# Altium schematic sheet Mynd_LINE_IN_JACK.SchDoc: Mynd-Line-In-Jack
size A3; ApprovedBy: Jianhua.zhong; CheckedBy: Aileen.Zheng; DrawnBy: GuoHui.Lin; Revision: 3.2; SheetNumber: 1; SheetTotal: 1; Model NO.: PS2307; ISSUE DATE: 20230820; REV DATE: 202301025
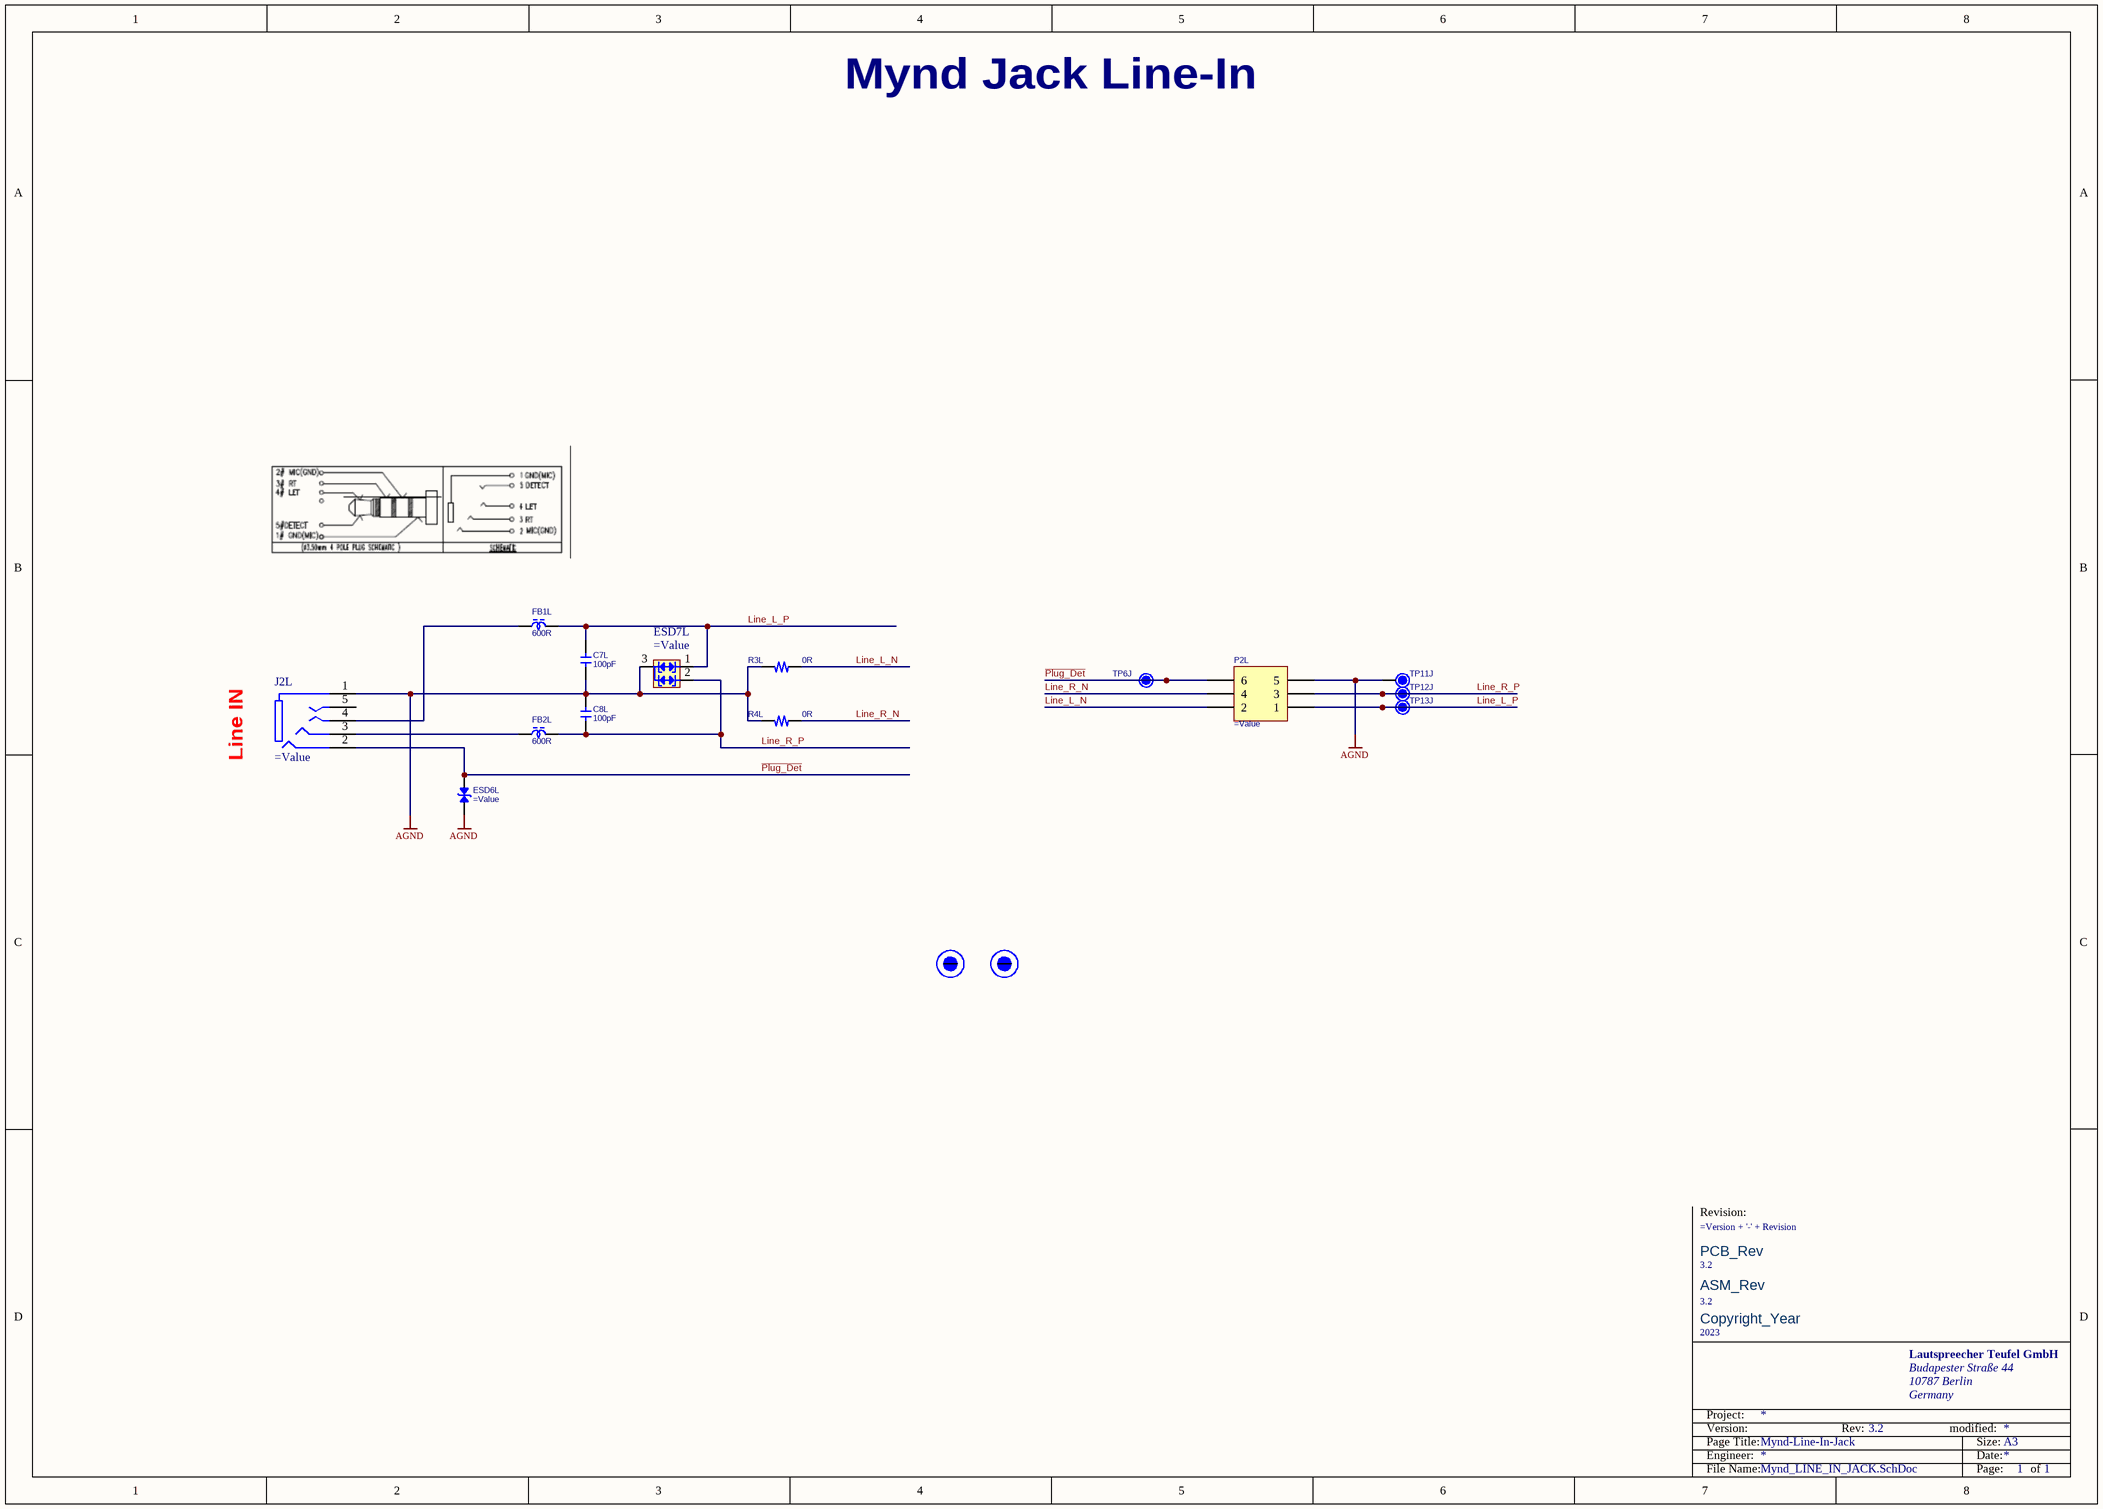
[diagram p0: Mynd_LINE_IN_JACK.SchDoc]

## Parts
C7L  100pF  [C0603X80]
C8L  100pF  [C0603X80]
ESD6L  (no value)  [DFN2_100X60X50_65]
ESD7L  (no value)  [SOT23-123]
FB1L  600R  [L0603]
FB2L  600R  [L0603]
J2L  (no value)  [PJ_MH35A080-F05J1BR-C]
MK1J  (no value)  [MARK]  (no BOM)
MK2J  (no value)  [MARK]  (no BOM)
P2L  (no value)  [WB200AW_2x3P]
R3L  0R  [R0603]
R4L  0R  [R0603]
Teufel_ASM_Label1J  3.2  [Teufel_ASM_Rev]  (no BOM)
Teufel_Copyright?  2023  [TEUFEL_COPYRIGHT]  (no BOM)
Teufel_PCB_Label1J  3.2  [Teufel_PCB_Rev]  (no BOM)
Teufel_PCB_Logo?  (no value)  [Teufel_NoLogo]  (no BOM)
TP6J  TP12  [TP120]  (value not drawn)  (no BOM)
TP11J  TP12  [TP120]  (value not drawn)  (no BOM)
TP12J  TP12  [TP120]  (value not drawn)  (no BOM)
TP13J  TP12  [TP120]  (value not drawn)  (no BOM)

## Nets
AGND: C7L.2 C8L.1 ESD6L.2 ESD7L.3 J2L.1 P2L.5 R3L.2 R4L.2 TP11J.1
~{Plug_Det}: ESD6L.1 J2L.2 P2L.6 TP6J.1
Line_L_N: P2L.2 R3L.1
Line_L_P: C7L.1 ESD7L.1 FB1L.2 P2L.1 TP13J.1
Line_R_N: P2L.4 R4L.1
Line_R_P: C8L.2 ESD7L.2 FB2L.2 P2L.3 TP12J.1
NetFB1L_1: FB1L.1 J2L.4
NetFB2L_1: FB2L.1 J2L.3

Not connected (* = marked no-connect by the designer): J2L 5; MK1J MK_B MK_T; MK2J MK_B MK_T

## Notes on the sheet
- Mynd Jack Line-In
- Line IN
- Revision:
- Lautspreecher Teufel GmbH
- Budapester Straße 44
- 10787 Berlin
- Germany
- Page Title:
- Engineer:
- Project:
- Version:
- Rev:
- modified:
- Date:
- Size:
- A3
- File Name:
- Page:
- of
- (in symbol CMP-00086-3) Copyright_Year
- (in symbol CMP-00087-3) PCB_Rev
- (in symbol CMP-00088-3) ASM_Rev

## Library data of the parts
C7L C8L = P-001-0637-10: PSHF SMD M CAP 100pF 50V ±10% 0603 X7R; Manufacturer: Multi-Sourced; Part_Number: Generic; Part_Type: Capacitor ceramic SMT; Tolerance: ±10%; Temp_Coefficient: X7R; Value: 100pF; Voltage: 50V
ESD6L = R-001-1582-2: SMD TVS 2P 5.5 DFN1006 CESD0501CU CTE; Part_Type: Diode TVS SMT; Voltage: 5.5V; Manufacturer: CTE; Part_Number: CESD0501CU; Value: CESD0501CU
ESD7L = R-001-1606-2: SMD TVS 3P 24V SOT-23 SM24C TONGKE; Part_Type: Diode TVS SMT; Voltage: 24V; Manufacturer: TONGKE; Part_Number: SM24C; Value: SM24C
FB1L FB2L = S-001-0006-21: PS SMD FERRITE BEAD 600OHM 25% 0603; Manufacturer: [TSA]; Part_Number: FCM1608KF-601T05; Part_Type: Ferrite Bead SMT; Current: 0.5A; Tolerance: 1:25%; Frequency: 100MHz; Value: 600R
J2L = C-001-1148-2: SMD PHONE JACK OD3.6mm FEMALE 5P; Manufacturer: MINGHENG; Part_Number: MH35A080-F05J1BR-C; Part_Type: Jack 3.5mm THT; Value: MH35A080-F05J1BR-C
MK1J MK2J = N-001-00003-2: MARK DOT; Design Item ID: MARK
P2L = C-001-1114-2: SMD WTB CONNECTOR 6P P2.0mm TIN; Manufacturer: MINGHENG; Part_Number: WB200AW-6; Part_Type: Connector WTB SMT; Value: WB200AW-6; System: Connector
R3L R4L = Q-001-0048-200: PS SMD RES. 0OHM 1/10W 5% 0603; Part_Type: Resistor SMT; Manufacturer: Multi-Sourced; Part_Number: Generic; Tolerance: 1%; Temp_Coefficient: 150ppm; Value: 0R; Wattage: 1/10W
Teufel_ASM_Label1J = CMP-00088-3: Teufel_ASM_Rev; Value: 3.2
Teufel_Copyright? = CMP-00086-3: Teufel_Copyright_Year; Value: 2023
Teufel_PCB_Label1J = CMP-00087-3: Teufel_PCB_Label; Value: 3.2
Teufel_PCB_Logo? = Teufel NoLogo: Teufel PCB NoLogo
TP6J TP11J TP12J TP13J = N-001-00010-2: Test Point; Design Item ID: TP